# EAGLE design module (EAGLE 9.5.2)

## Sheet 1 of 2
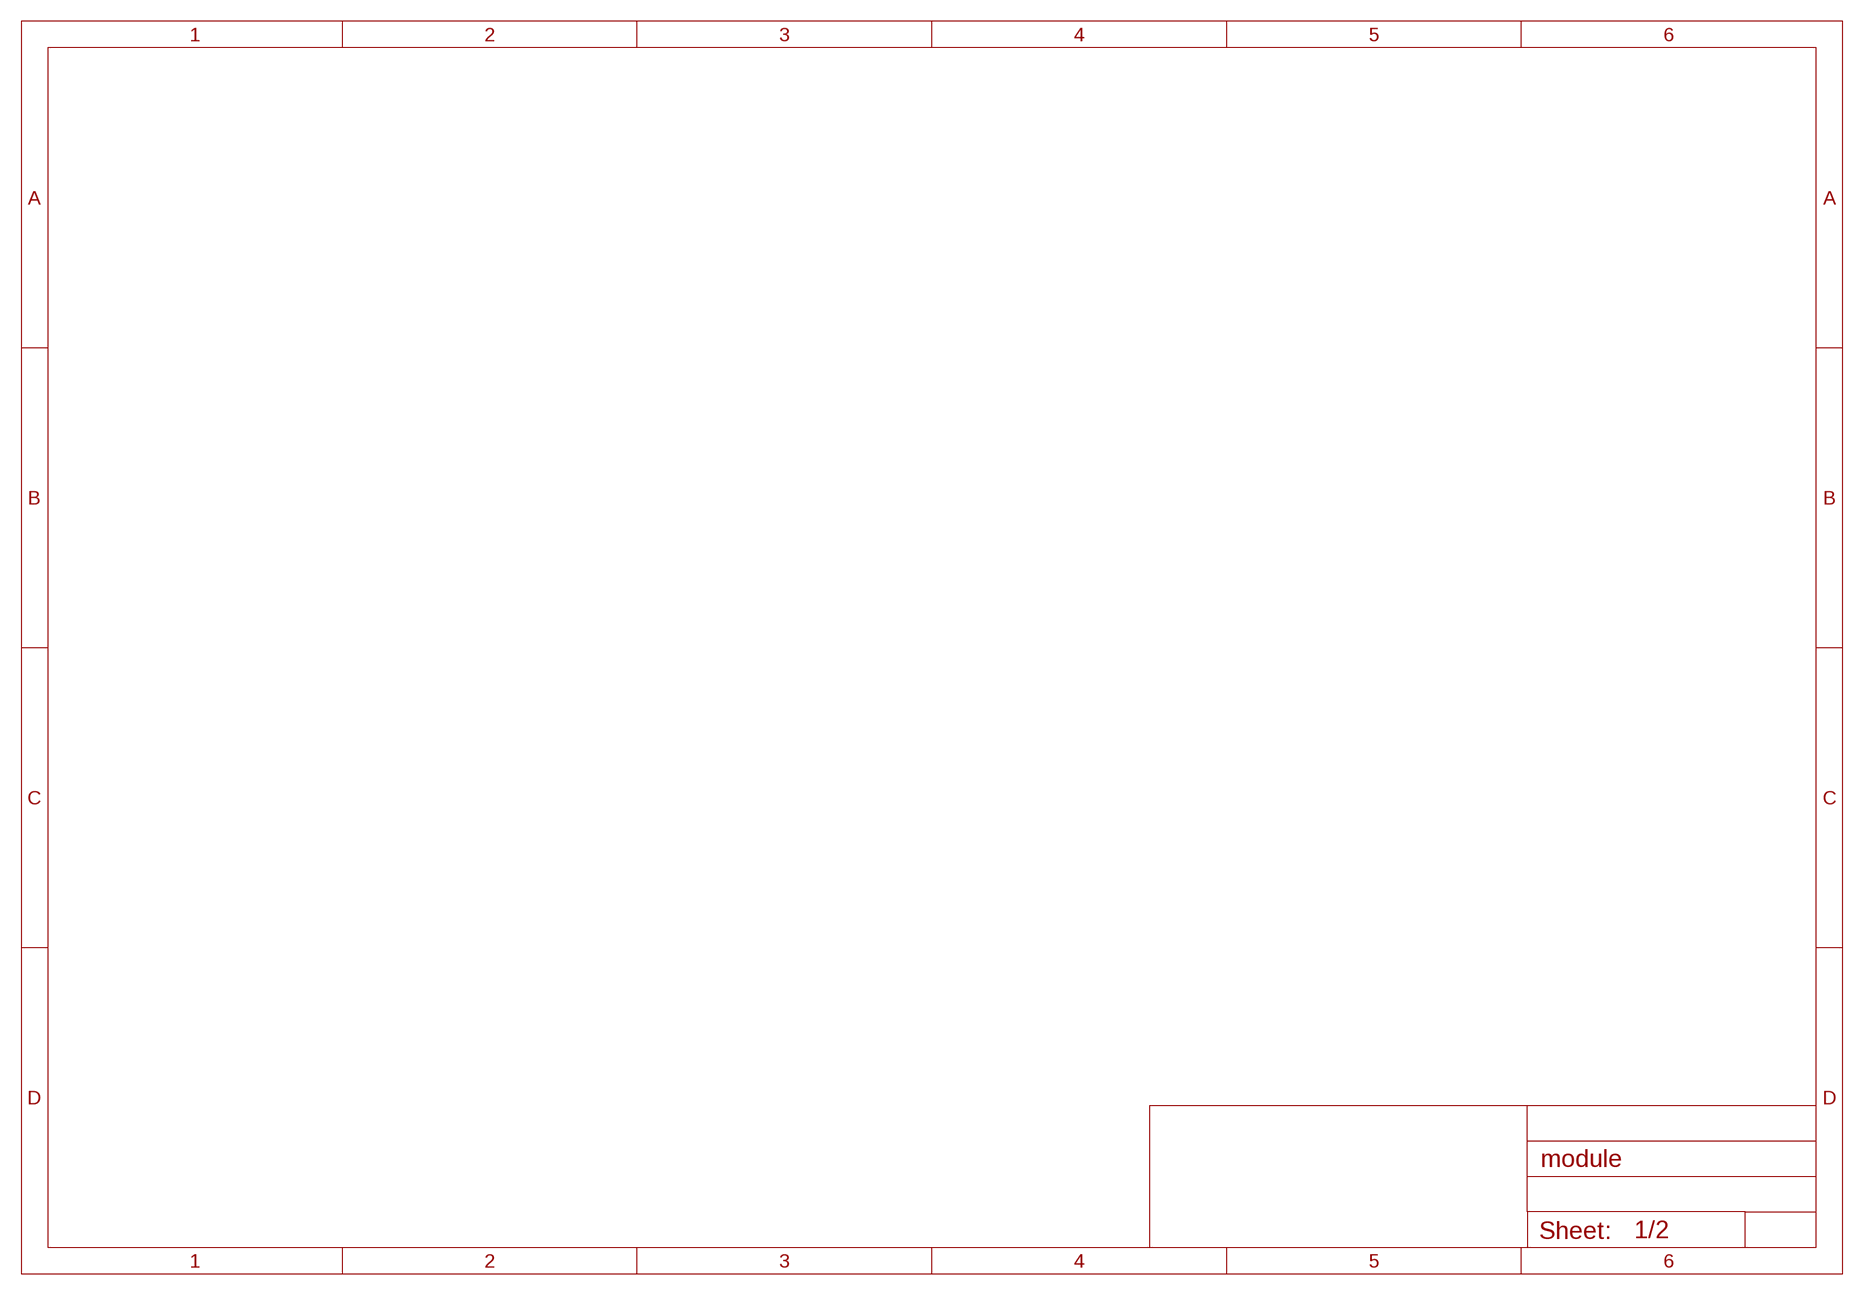
[diagram p0: schematic, sheet 1]

## Sheet 2 of 2
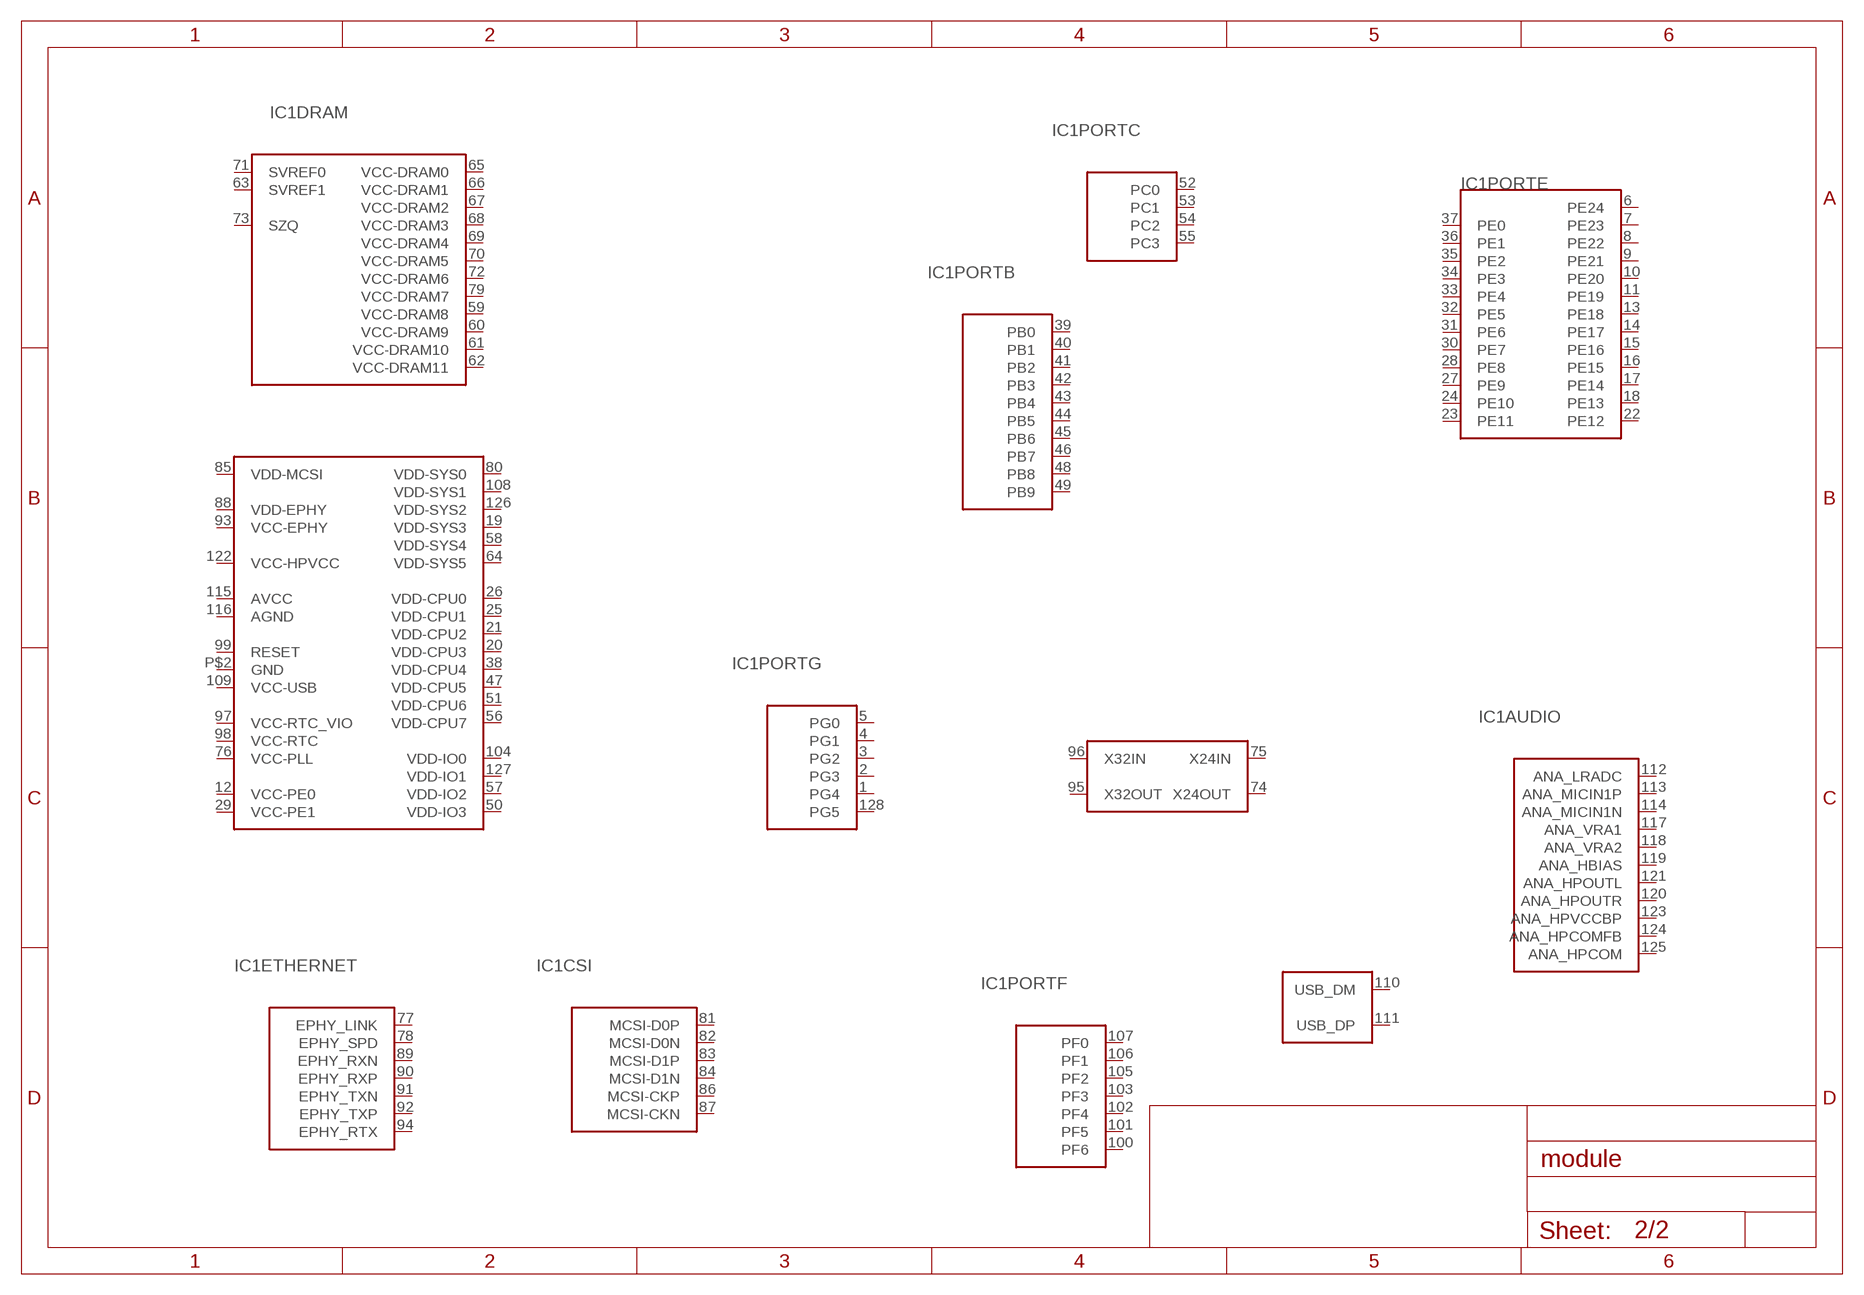
[diagram p1: schematic, sheet 2]

### Parts
IC1  V3S  [QFP-128]
Unconnected: IC1.1(PORTG:PG4) IC1.2(PORTG:PG3) IC1.3(PORTG:PG2) IC1.4(PORTG:PG1) IC1.5(PORTG:PG0) IC1.6(PORTE:PE24) IC1.7(PORTE:PE23) IC1.8(PORTE:PE22) IC1.9(PORTE:PE21) IC1.10(PORTE:PE20) IC1.11(PORTE:PE19) IC1.12(POWER:VCC-PE0) IC1.13(PORTE:PE18) IC1.14(PORTE:PE17) IC1.15(PORTE:PE16) IC1.16(PORTE:PE15) IC1.17(PORTE:PE14) IC1.18(PORTE:PE13) IC1.19(POWER:VDD-SYS3) IC1.20(POWER:VDD-CPU3) IC1.21(POWER:VDD-CPU2) IC1.22(PORTE:PE12) IC1.23(PORTE:PE11) IC1.24(PORTE:PE10) IC1.25(POWER:VDD-CPU1) IC1.26(POWER:VDD-CPU0) IC1.27(PORTE:PE9) IC1.28(PORTE:PE8) IC1.29(POWER:VCC-PE1) IC1.30(PORTE:PE7) IC1.31(PORTE:PE6) IC1.32(PORTE:PE5) IC1.33(PORTE:PE4) IC1.34(PORTE:PE3) IC1.35(PORTE:PE2) IC1.36(PORTE:PE1) IC1.37(PORTE:PE0) IC1.38(POWER:VDD-CPU4) IC1.39(PORTB:PB0) IC1.40(PORTB:PB1) IC1.41(PORTB:PB2) IC1.42(PORTB:PB3) IC1.43(PORTB:PB4) IC1.44(PORTB:PB5) IC1.45(PORTB:PB6) IC1.46(PORTB:PB7) IC1.47(POWER:VDD-CPU5) IC1.48(PORTB:PB8) IC1.49(PORTB:PB9) IC1.50(POWER:VDD-IO3) IC1.51(POWER:VDD-CPU6) IC1.52(PORTC:PC0) IC1.53(PORTC:PC1) IC1.54(PORTC:PC2) IC1.55(PORTC:PC3) IC1.56(POWER:VDD-CPU7) IC1.57(POWER:VDD-IO2) IC1.58(POWER:VDD-SYS4) IC1.59(DRAM:VCC-DRAM8) IC1.60(DRAM:VCC-DRAM9) IC1.61(DRAM:VCC-DRAM10) IC1.62(DRAM:VCC-DRAM11) IC1.63(DRAM:SVREF1) IC1.64(POWER:VDD-SYS5) IC1.65(DRAM:VCC-DRAM0) IC1.66(DRAM:VCC-DRAM1) IC1.67(DRAM:VCC-DRAM2) IC1.68(DRAM:VCC-DRAM3) IC1.69(DRAM:VCC-DRAM4) IC1.70(DRAM:VCC-DRAM5) IC1.71(DRAM:SVREF0) IC1.72(DRAM:VCC-DRAM6) IC1.73(DRAM:SZQ) IC1.74(CLOCK:X24OUT) IC1.75(CLOCK:X24IN) IC1.76(POWER:VCC-PLL) IC1.77(ETHERNET:EPHY_LINK) IC1.78(ETHERNET:EPHY_SPD) IC1.79(DRAM:VCC-DRAM7) IC1.80(POWER:VDD-SYS0) IC1.81(CSI:MCSI-D0P) IC1.82(CSI:MCSI-D0N) IC1.83(CSI:MCSI-D1P) IC1.84(CSI:MCSI-D1N) IC1.85(POWER:VDD-MCSI) IC1.86(CSI:MCSI-CKP) IC1.87(CSI:MCSI-CKN) IC1.88(POWER:VDD-EPHY) IC1.89(ETHERNET:EPHY_RXN) IC1.90(ETHERNET:EPHY_RXP) IC1.91(ETHERNET:EPHY_TXN) IC1.92(ETHERNET:EPHY_TXP) IC1.93(POWER:VCC-EPHY) IC1.94(ETHERNET:EPHY_RTX) IC1.95(CLOCK:X32OUT) IC1.96(CLOCK:X32IN) IC1.97(POWER:VCC-RTC_VIO) IC1.98(POWER:VCC-RTC) IC1.99(POWER:RESET) IC1.100(PORTF:PF6) IC1.101(PORTF:PF5) IC1.102(PORTF:PF4) IC1.103(PORTF:PF3) IC1.104(POWER:VDD-IO0) IC1.105(PORTF:PF2) IC1.106(PORTF:PF1) IC1.107(PORTF:PF0) IC1.108(POWER:VDD-SYS1) IC1.109(POWER:VCC-USB) IC1.110(USB:USB_DM) IC1.111(USB:USB_DP) IC1.112(AUDIO:ANA_LRADC) IC1.113(AUDIO:ANA_MICIN1P) IC1.114(AUDIO:ANA_MICIN1N) IC1.115(POWER:AVCC) IC1.116(POWER:AGND) IC1.117(AUDIO:ANA_VRA1) IC1.118(AUDIO:ANA_VRA2) IC1.119(AUDIO:ANA_HBIAS) IC1.120(AUDIO:ANA_HPOUTR) IC1.121(AUDIO:ANA_HPOUTL) IC1.122(POWER:VCC-HPVCC) IC1.123(AUDIO:ANA_HPVCCBP) IC1.124(AUDIO:ANA_HPCOMFB) IC1.125(AUDIO:ANA_HPCOM) IC1.126(POWER:VDD-SYS2) IC1.127(POWER:VDD-IO1) IC1.128(PORTG:PG5) IC1.P$2(POWER:GND)

## Library data of the parts
IC1 = parts-allwinner:V3S

## Board
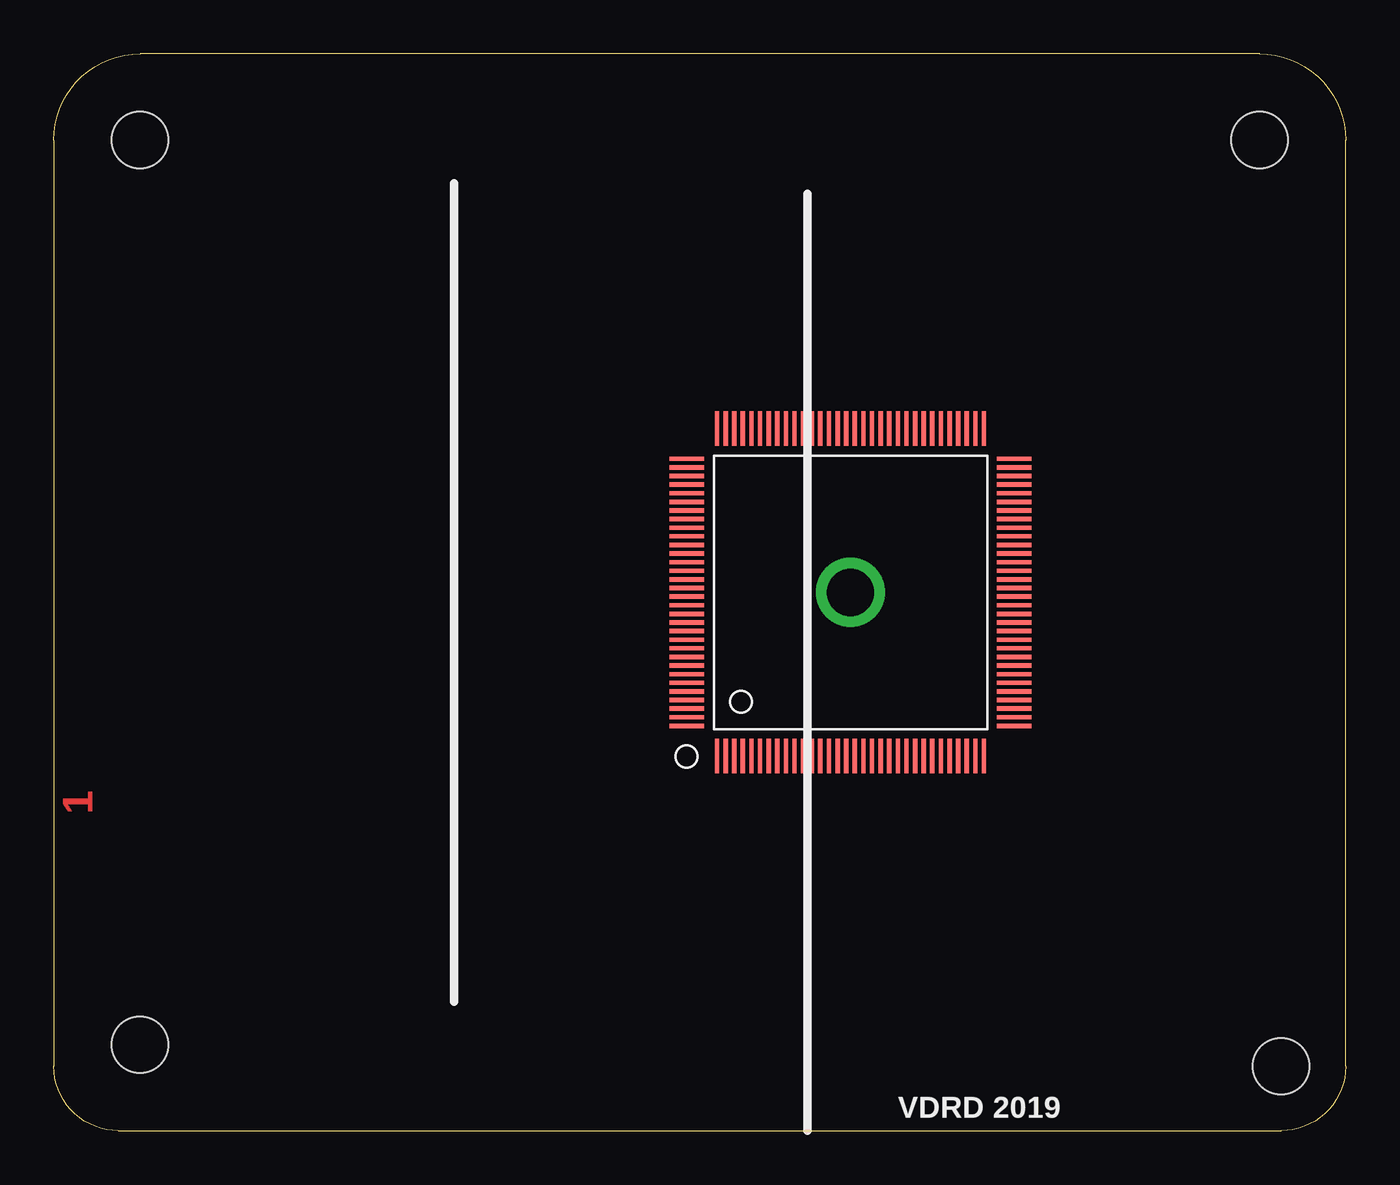
[diagram p2: board, top side]
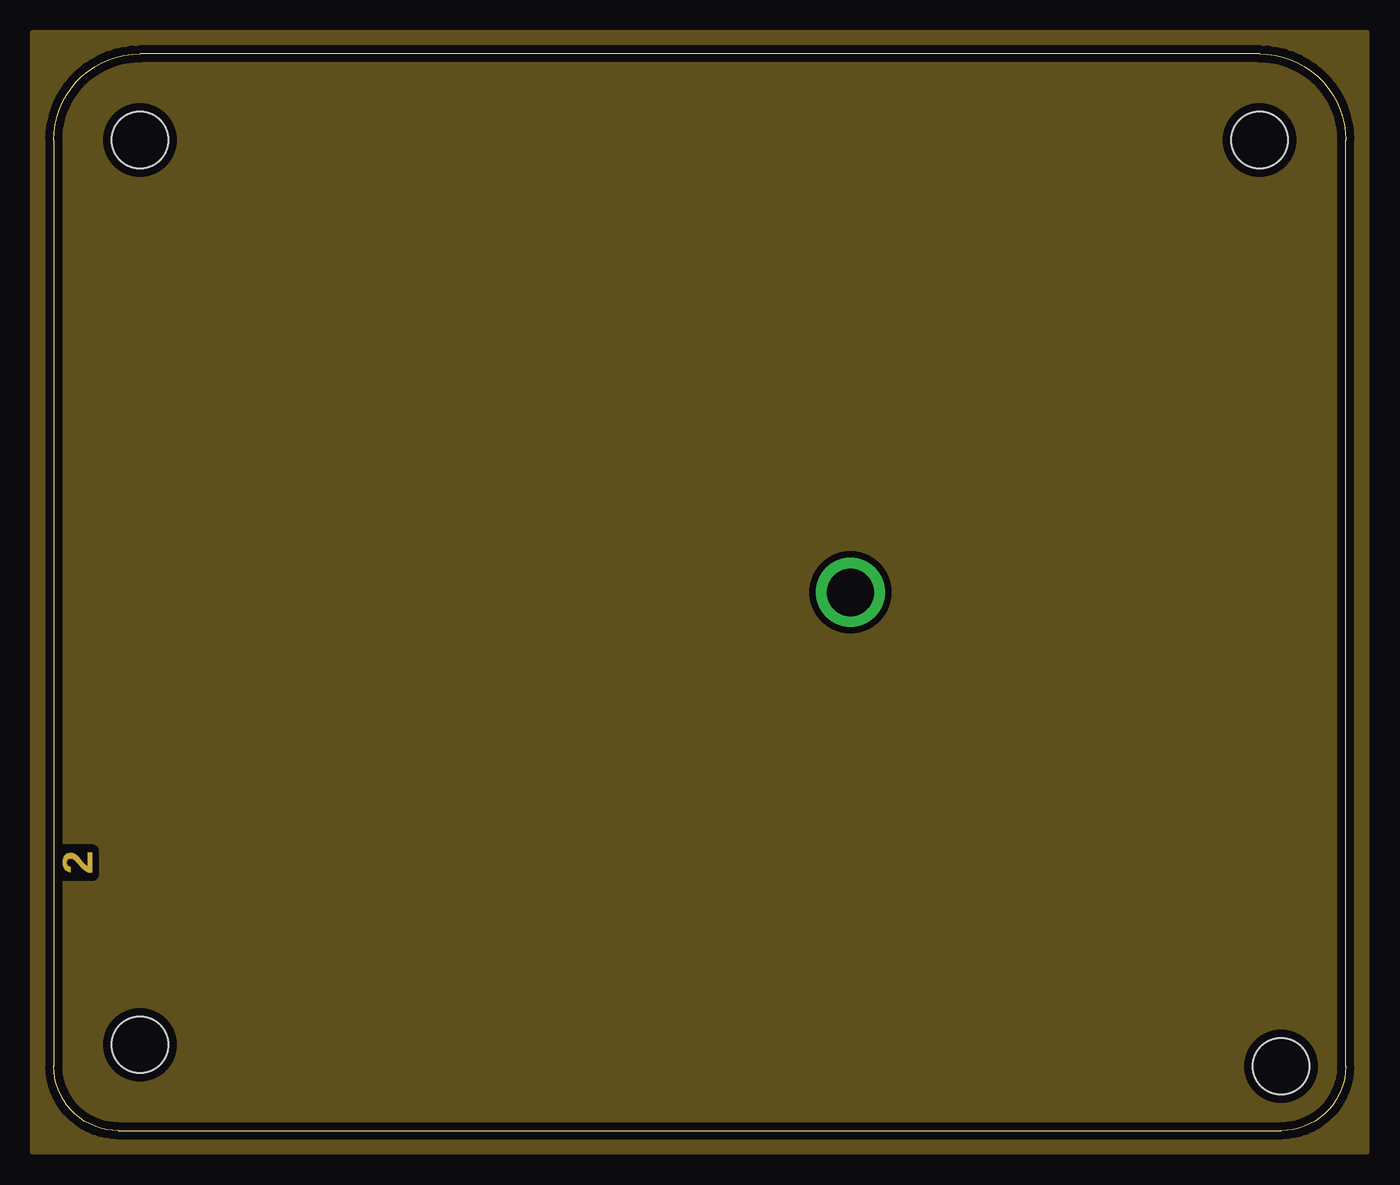
[diagram p3: board, inner layer Route2]
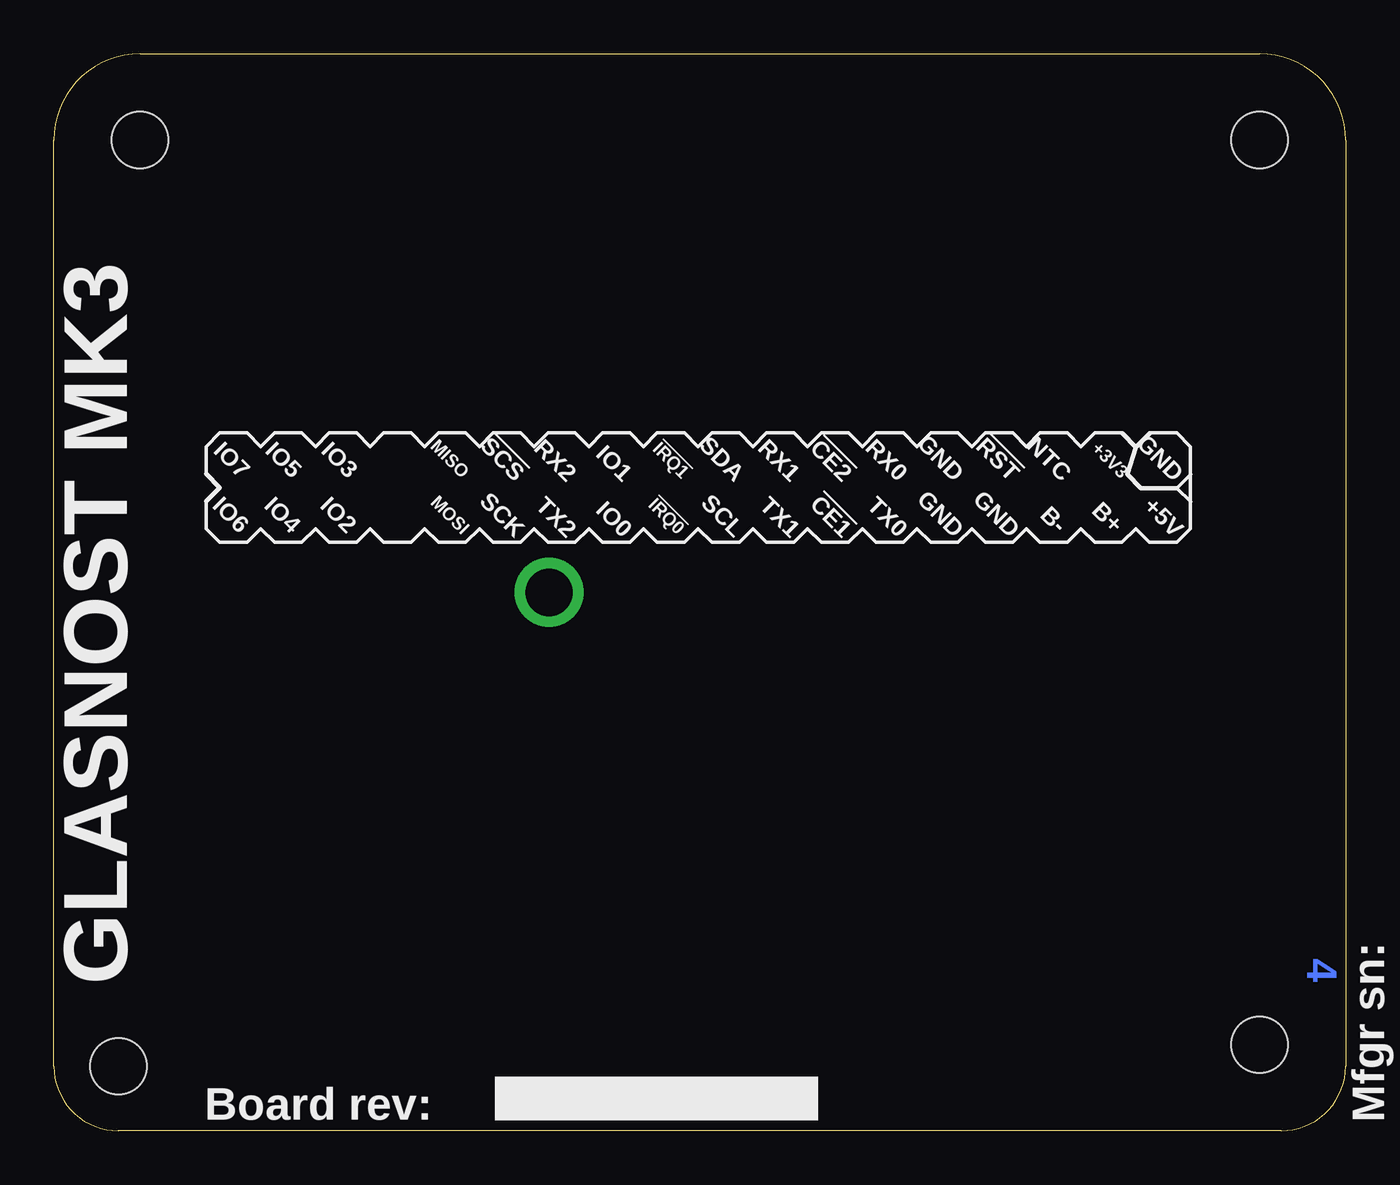
[diagram p4: board, bottom side, seen from below]

Size 60 x 50 mm. Coordinates in mm from the lower left corner, seen from the top.
Outline: 3,0 57,0 arc90 60,3 60,46 arc90 56,50 4,50 arc90 0,46 0,3 arc90 3,0
Copper layers (1+2*15+16): Top 0.035mm / dielectric 0.2mm / Route2 0.0175mm / dielectric 0.465mm / Route15 0.0175mm / dielectric 0.2mm / Bottom 0.035mm
Design rules "default *": minimum track width 5mil, minimum drill 0.2mm, track to track 5mil, track to pad 5mil, pad to pad 5mil, via to via 5mil, smd to smd 5mil, copper to edge 0.4mm, drill to drill 6mil, minimum pad ring 4mil, minimum via ring 4mil, stop-mask expansion 0.1mm, vias tented up to drill 0.3mm, thermal gap 10mil
Holes 2.6 mm at 4,46 4,4 57,3 56,46
tRestrict: area 1,43 to 7,49; area 1,1 to 7,7; area 54,0 to 60,6; area 0,5.2 to 2,16.2; area 53,43 to 59,49
bRestrict: area 1,43 to 7,49; area 1,1 to 7,7; area 54,0 to 60,6; area 0,5.2 to 2,16.2; area 53,43 to 59,49

### Footprints (pad centres in the part's own frame; a part is rotated, then mirrored left to right if it is on the bottom)
QFP-128 = smd 0.2 x 1.6: 1 -6.2,-7.6; 2 -5.8,-7.6; 3 -5.4,-7.6; 4 -5,-7.6; 5 -4.6,-7.6; 6 -4.2,-7.6; 7 -3.8,-7.6; 8 -3.4,-7.6; 9 -3,-7.6; 10 -2.6,-7.6; 11 -2.2,-7.6; 12 -1.8,-7.6; 13 -1.4,-7.6; 14 -1,-7.6; 15 -0.6,-7.6; 16 -0.2,-7.6; 17 0.2,-7.6; 18 0.6,-7.6; 19 1,-7.6; 20 1.4,-7.6; 21 1.8,-7.6; 22 2.2,-7.6; 23 2.6,-7.6; 24 3,-7.6; 25 3.4,-7.6; 26 3.8,-7.6; 27 4.2,-7.6; 28 4.6,-7.6; 29 5,-7.6; 30 5.4,-7.6; 31 5.8,-7.6; 32 6.2,-7.6; 65 6.2,7.6; 66 5.8,7.6; 67 5.4,7.6; 68 5,7.6; 69 4.6,7.6; 70 4.2,7.6; 71 3.8,7.6; 72 3.4,7.6; 73 3,7.6; 74 2.6,7.6; 75 2.2,7.6; 76 1.8,7.6; 77 1.4,7.6; 78 1,7.6; 79 0.6,7.6; 80 0.2,7.6; 81 -0.2,7.6; 82 -0.6,7.6; 83 -1,7.6; 84 -1.4,7.6; 85 -1.8,7.6; 86 -2.2,7.6; 87 -2.6,7.6; 88 -3,7.6; 89 -3.4,7.6; 90 -3.8,7.6; 91 -4.2,7.6; 92 -4.6,7.6; 93 -5,7.6; 94 -5.4,7.6; 95 -5.8,7.6; 96 -6.2,7.6 | smd 1.6 x 0.2: 33 7.6,-6.2; 34 7.6,-5.8; 35 7.6,-5.4; 36 7.6,-5; 37 7.6,-4.6; 38 7.6,-4.2; 39 7.6,-3.8; 40 7.6,-3.4; 41 7.6,-3; 42 7.6,-2.6; 43 7.6,-2.2; 44 7.6,-1.8; 45 7.6,-1.4; 46 7.6,-1; 47 7.6,-0.6; 48 7.6,-0.2; 49 7.6,0.2; 50 7.6,0.6; 51 7.6,1; 52 7.6,1.4; 53 7.6,1.8; 54 7.6,2.2; 55 7.6,2.6; 56 7.6,3; 57 7.6,3.4; 58 7.6,3.8; 59 7.6,4.2; 60 7.6,4.6; 61 7.6,5; 62 7.6,5.4; 63 7.6,5.8; 64 7.6,6.2; 97 -7.6,6.2; 98 -7.6,5.8; 99 -7.6,5.4; 100 -7.6,5; 101 -7.6,4.6; 102 -7.6,4.2; 103 -7.6,3.8; 104 -7.6,3.4; 105 -7.6,3; 106 -7.6,2.6; 107 -7.6,2.2; 108 -7.6,1.8; 109 -7.6,1.4; 110 -7.6,1; 111 -7.6,0.6; 112 -7.6,0.2; 113 -7.6,-0.2; 114 -7.6,-0.6; 115 -7.6,-1; 116 -7.6,-1.4; 117 -7.6,-1.8; 118 -7.6,-2.2; 119 -7.6,-2.6; 120 -7.6,-3; 121 -7.6,-3.4; 122 -7.6,-3.8; 123 -7.6,-4.2; 124 -7.6,-4.6; 125 -7.6,-5; 126 -7.6,-5.4; 127 -7.6,-5.8; 128 -7.6,-6.2 | drill 2.2 pad 3.2: P$2 0,0

### Placement (x,y rotation side)
IC1  37,25 0 top

### Tracks (layer width: path | path; a pad name or v marks a point on that pad's centre or on a via)
GND
  pour Route2 (isolate 0.3, rank 6, no thermals): -1,-1 -1,51 61,51 61,-1

### Text on the board
Top: 1
Route2: 2
Route15: 3
Bottom: 4
tPlace: VDRD 2019
bPlace: GND | +3V3 | NTC | !RST | GND | RX0 | !CE2 | RX1 | SDA | !IRQ1 | IO1 | RX2 | !SCS | MISO | IO3 | IO5 | IO7 | +5V | B+ | B- | GND | GND | TX0 | !CE1 | TX1 | SCL | !IRQ0 | IO0 | TX2 | SCK | MOSI | IO2 | IO4 | IO6
bNames: GLASNOST MK3 | Mfgr sn: | Board rev: